# EAGLE schematic LightingUPS-Sensor_v1 (EAGLE 7.6.0)
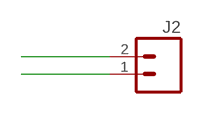
[diagram p0: schematic, sheet 1]

## Parts
J2  M02PTH  [1X02]

## Nets
N$1: J2.2
N$2: J2.1

## Library data of the parts
J2 = SparkFun-Connectors:M02: Standard 2-pin 0.1" header. Use with - straight break away headers ( PRT-00116) - right angle break away headers (PRT-00553) - swiss pins (PRT-00743) - machine pins (PRT-00117) - female headers (PRT-00115) Molex polarized connector foot print use with: PRT-08233 with associated crimp pins and housings. 2.54_SCREWTERM for use with PRT-10571. 3.5mm Screw Terminal footprints for PRT-08084 5mm Screw Terminal footprints for use with PRT-08432